# EAGLE schematic project (EAGLE 6.3)

## Sheet 1 of 6
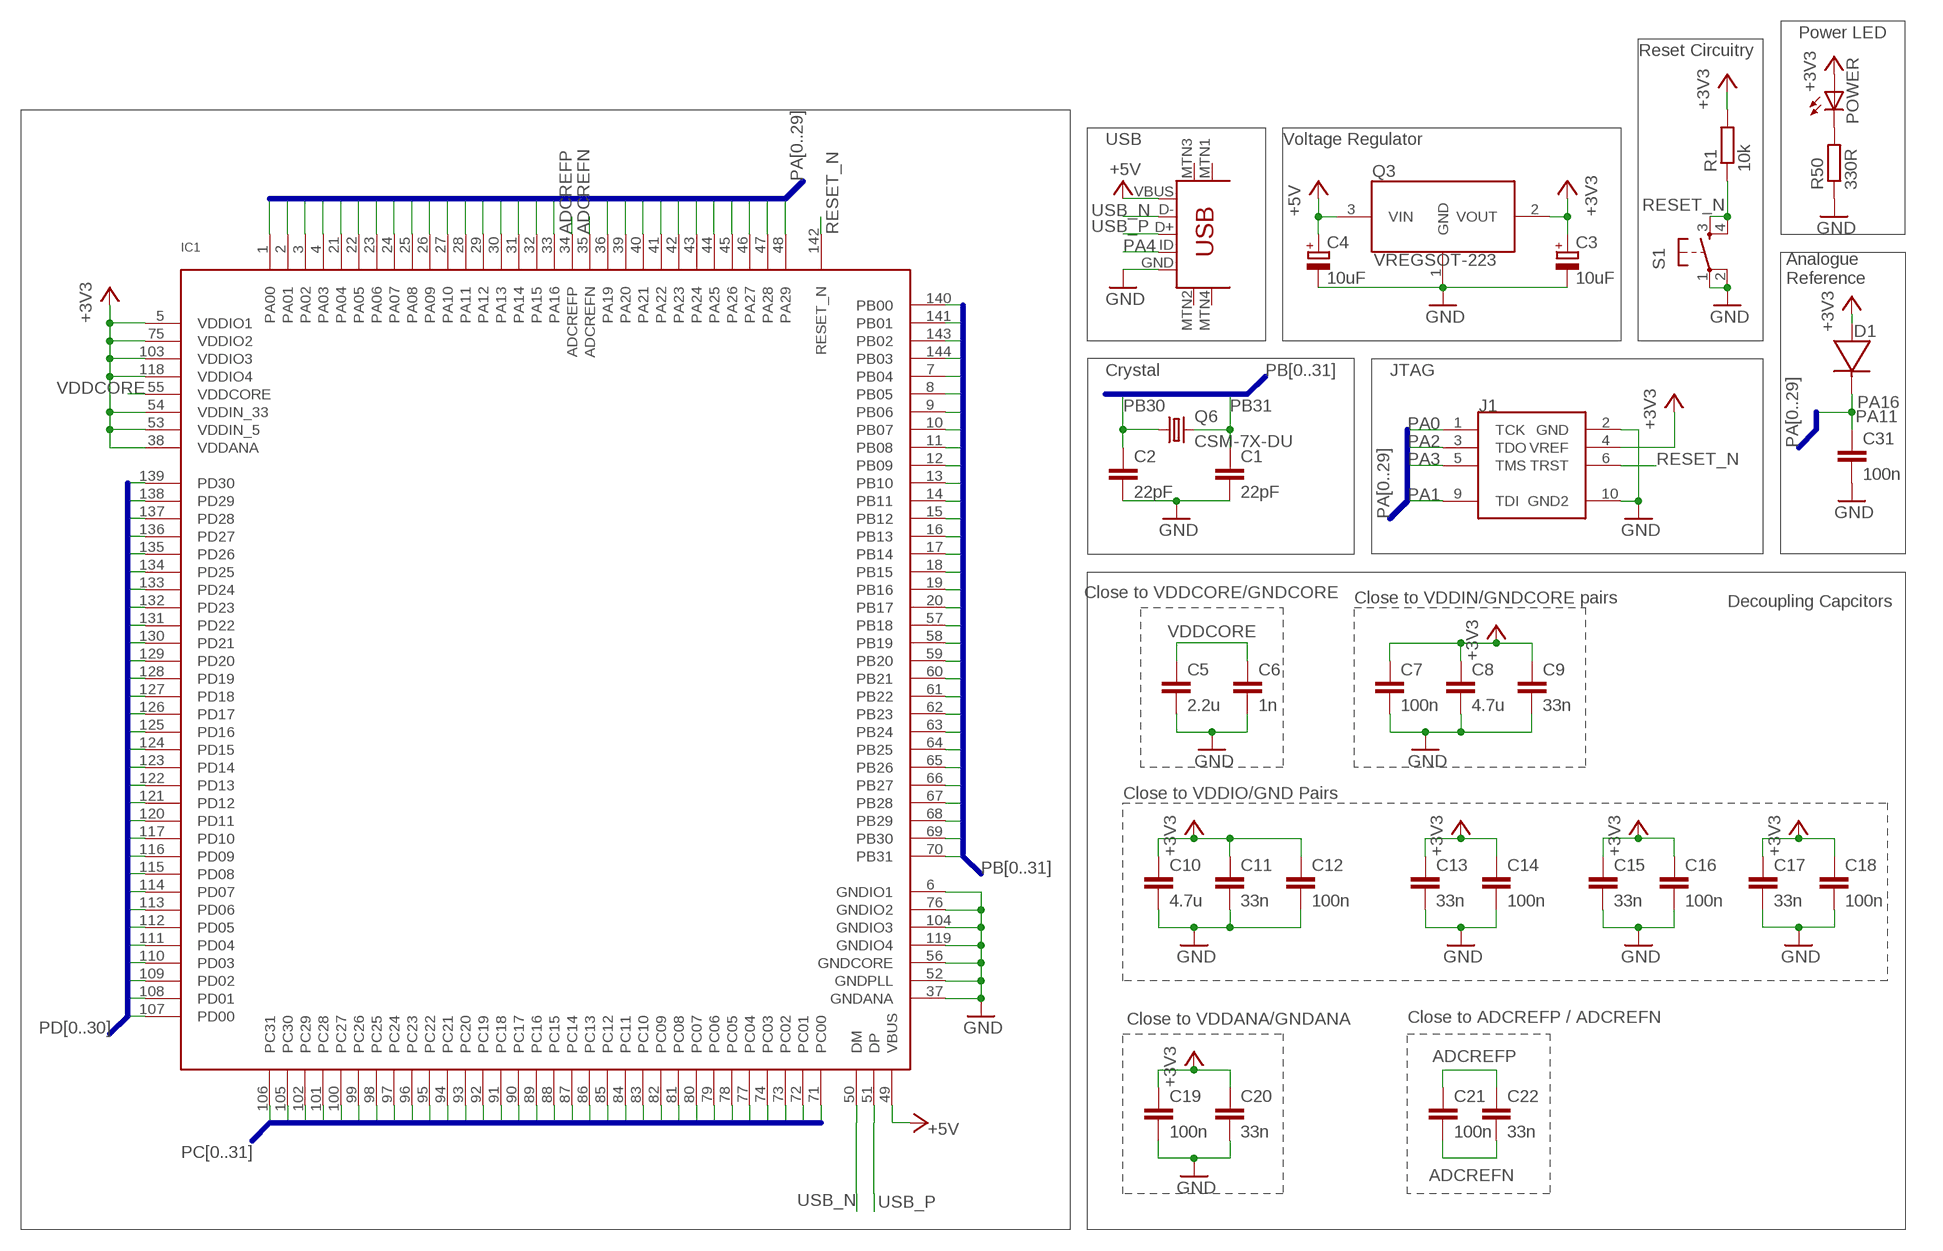
[diagram p0: schematic, sheet 1]

### Parts
C1  22pF  C-EUC0603  [C0603]
C2  22pF  C-EUC0603  [C0603]
C3  10uF  CPOL-EUSMCP  [SMC_P]
C4  10uF  CPOL-EUSMCP  [SMC_P]
C5  2.2u  C-EUC0603  [C0603]
C6  1n  C-EUC0603  [C0603]
C7  100n  C-EUC0603  [C0603]
C8  4.7u  C-EUC0603  [C0603]
C9  33n  C-EUC0603  [C0603]
C10  4.7u  C-EUC0603  [C0603]
C11  33n  C-EUC0603  [C0603]
C12  100n  C-EUC0603  [C0603]
C13  33n  C-EUC0603  [C0603]
C14  100n  C-EUC0603  [C0603]
C15  33n  C-EUC0603  [C0603]
C16  100n  C-EUC0603  [C0603]
C17  33n  C-EUC0603  [C0603]
C18  100n  C-EUC0603  [C0603]
C19  100n  C-EUC0603  [C0603]
C20  33n  C-EUC0603  [C0603]
C21  100n  C-EUC0603  [C0603]
C22  33n  C-EUC0603  [C0603]
C31  100n  C-EUC0603  [C0603]
D1  DIODESMD  [SMC_C]
IC1  UC3C  [TQFP144]
J1  JTAG2.54MM2X5TH  [2.54MM2X5TH]
POWER  LED1206  [LED-1206]
Q3  VREGSOT-223  [SOT-223]
Q6  CSM-7X-DU  [CSM-7X-DU]
R1  10k  R0603  [R0603]
R50  330R  R0603  [R0603]
S1  TAC_SWITCHSMD  [TACTILE_SWITCH_SMD]
U$1  USB-MINIB-5PIN  [USB-MINIB]

### Nets
+3V3: C3.+ C7.1 C8.1 C9.1 C10.1 C11.1 C12.1 C13.1 C14.1 C15.1 C16.1 C17.1 C18.1 C19.1 C20.1 D1.+(ANODE) IC1.5(VDDIO1) IC1.38(VDDANA) IC1.53(VDDIN_5) IC1.54(VDDIN_33) IC1.75(VDDIO2) IC1.103(VDDIO3) IC1.118(VDDIO4) J1.4(VREF) POWER.A Q3.2(VOUT) R1.2 ; also sheet 2,3,4,5,6
+5V: C4.+ IC1.49(VBUS) Q3.3(VIN) U$1.VBUS ; also sheet 6
ADCREFN: C21.2 C22.2 IC1.35(ADCREFN)
ADCREFP: C21.1 C22.1 IC1.34(ADCREFP)
GND: C1.2 C2.2 C3.- C4.- C5.2 C6.2 C7.2 C8.2 C9.2 C10.2 C11.2 C12.2 C13.2 C14.2 C15.2 C16.2 C17.2 C18.2 C19.2 C20.2 C31.2 IC1.6(GNDIO1) IC1.37(GNDANA) IC1.52(GNDPLL) IC1.56(GNDCORE) IC1.76(GNDIO2) IC1.104(GNDIO3) IC1.119(GNDIO4) J1.2(GND) J1.10(GND2) Q3.1(GND) R50.1 S1.1 S1.2 U$1.GND ; also sheet 2,3,4,5,6
N$36: POWER.C R50.2
PA0: IC1.1(PA00) J1.1(TCK)
PA1: IC1.2(PA01) J1.9(TDI)
PA2: IC1.3(PA02) J1.3(TDO)
PA3: IC1.4(PA03) J1.5(TMS)
PA4: IC1.21(PA04) U$1.ID
PA5: IC1.22(PA05) ; also sheet 6
PA6: IC1.23(PA06) ; also sheet 5
PA7: IC1.24(PA07) ; also sheet 5
PA8: IC1.25(PA08) ; also sheet 5
PA9: IC1.26(PA09) ; also sheet 5
PA10: IC1.27(PA10) ; also sheet 6
PA12: IC1.29(PA12) ; also sheet 6
PA13: IC1.30(PA13) ; also sheet 6
PA14: IC1.31(PA14) ; also sheet 6
PA15: IC1.32(PA15) ; also sheet 3
PA16: C31.1 D1.-(CATHODE) IC1.28(PA11) IC1.33(PA16)
PA19: IC1.36(PA19) ; also sheet 3
PA20: IC1.39(PA20) ; also sheet 3
PA21: IC1.40(PA21) ; also sheet 3
PA22: IC1.41(PA22) ; also sheet 3
PA23: IC1.42(PA23) ; also sheet 3
PA24: IC1.43(PA24) ; also sheet 3
PA25: IC1.44(PA25) ; also sheet 3
PA26: IC1.45(PA26) ; also sheet 3
PA27: IC1.46(PA27) ; also sheet 3
PA28: IC1.47(PA28) ; also sheet 3
PA29: IC1.48(PA29) ; also sheet 3
PB0: IC1.140(PB00) ; also sheet 3
PB1: IC1.141(PB01) ; also sheet 3
PB2: IC1.143(PB02) ; also sheet 3
PB3: IC1.144(PB03) ; also sheet 3
PB4: IC1.7(PB04) ; also sheet 3
PB5: IC1.8(PB05) ; also sheet 3
PB6: IC1.9(PB06) ; also sheet 3
PB7: IC1.10(PB07) ; also sheet 3
PB8: IC1.11(PB08) ; also sheet 5
PB9: IC1.12(PB09) ; also sheet 5
PB10: IC1.13(PB10) ; also sheet 5
PB11: IC1.14(PB11) ; also sheet 5
PB12: IC1.15(PB12) ; also sheet 5
PB13: IC1.16(PB13) ; also sheet 5
PB14: IC1.17(PB14) ; also sheet 5
PB15: IC1.18(PB15) ; also sheet 5
PB16: IC1.19(PB16) ; also sheet 5
PB17: IC1.20(PB17) ; also sheet 6
PB18: IC1.57(PB18) ; also sheet 6
PB19: IC1.58(PB19) ; also sheet 2,6
PB20: IC1.59(PB20) ; also sheet 2,6
PB21: IC1.60(PB21) ; also sheet 2,6
PB22: IC1.61(PB22) ; also sheet 6
PB23: IC1.62(PB23) ; also sheet 6
PB24: IC1.63(PB24) ; also sheet 6
PB25: IC1.64(PB25) ; also sheet 2,6
PB26: IC1.65(PB26) ; also sheet 2
PB27: IC1.66(PB27) ; also sheet 6
PB28: IC1.67(PB28) ; also sheet 6
PB29: IC1.68(PB29) ; also sheet 6
PB30: C2.1 IC1.69(PB30) Q6.1
PB31: C1.1 IC1.70(PB31) Q6.2
PC0: IC1.71(PC00) ; also sheet 6
PC1: IC1.72(PC01) ; also sheet 6
PC2: IC1.73(PC02) ; also sheet 2,6
PC3: IC1.74(PC03) ; also sheet 2,6
PC4: IC1.77(PC04) ; also sheet 6
PC5: IC1.78(PC05) ; also sheet 6
PC6: IC1.79(PC06) ; also sheet 6
PC7: IC1.80(PC07)
PC8: IC1.81(PC08) ; also sheet 4
PC9: IC1.82(PC09) ; also sheet 6
PC10: IC1.83(PC10) ; also sheet 6
PC11: IC1.84(PC11) ; also sheet 6
PC12: IC1.85(PC12) ; also sheet 6
PC13: IC1.86(PC13) ; also sheet 6
PC14: IC1.87(PC14) ; also sheet 4
PC15: IC1.88(PC15) ; also sheet 4
PC16: IC1.89(PC16) ; also sheet 4
PC17: IC1.90(PC17) ; also sheet 4
PC18: IC1.91(PC18) ; also sheet 4
PC19: IC1.92(PC19) ; also sheet 4
PC20: IC1.93(PC20) ; also sheet 4
PC21: IC1.94(PC21) ; also sheet 4
PC22: IC1.95(PC22) ; also sheet 4
PC23: IC1.96(PC23) ; also sheet 4
PC24: IC1.97(PC24) ; also sheet 4
PC25: IC1.98(PC25) ; also sheet 4
PC26: IC1.99(PC26) ; also sheet 4
PC27: IC1.100(PC27) ; also sheet 4
PC28: IC1.101(PC28) ; also sheet 4
PC29: IC1.102(PC29) ; also sheet 4
PC30: IC1.105(PC30) ; also sheet 4
PC31: IC1.106(PC31) ; also sheet 4
PD0: IC1.107(PD00) ; also sheet 4
PD1: IC1.108(PD01) ; also sheet 4
PD2: IC1.109(PD02) ; also sheet 4
PD3: IC1.110(PD03) ; also sheet 4
PD4: IC1.111(PD04) ; also sheet 6
PD5: IC1.112(PD05) ; also sheet 4
PD6: IC1.113(PD06) ; also sheet 4
PD7: IC1.114(PD07) ; also sheet 4
PD8: IC1.115(PD08) ; also sheet 4
PD9: IC1.116(PD09) ; also sheet 4
PD10: IC1.117(PD10) ; also sheet 4
PD11: IC1.120(PD11) ; also sheet 4
PD12: IC1.121(PD12) ; also sheet 4
PD13: IC1.122(PD13) ; also sheet 4
PD14: IC1.123(PD14) ; also sheet 4
PD15: IC1.124(PD15) ; also sheet 4
PD16: IC1.125(PD16)
PD17: IC1.126(PD17) ; also sheet 4
PD18: IC1.127(PD18)
PD19: IC1.128(PD19)
PD20: IC1.129(PD20) ; also sheet 4
PD21: IC1.130(PD21) ; also sheet 4
PD22: IC1.131(PD22)
PD23: IC1.132(PD23) ; also sheet 6
PD24: IC1.133(PD24) ; also sheet 4
PD25: IC1.134(PD25) ; also sheet 6
PD26: IC1.135(PD26) ; also sheet 6
PD27: IC1.136(PD27) ; also sheet 6
PD28: IC1.137(PD28) ; also sheet 6
PD29: IC1.138(PD29) ; also sheet 6
PD30: IC1.139(PD30) ; also sheet 6
RESET_N: IC1.142(RESET_N) J1.6(TRST) R1.1 S1.3 S1.4
USB_N: IC1.50(DM) U$1.D-
USB_P: IC1.51(DP) U$1.D+
VDDCORE: C5.1 C6.1 IC1.55(VDDCORE)
Unconnected: U$1.MTN1(MTN2) U$1.MTN2(MTN3) U$1.MTN3(MTN1) U$1.MTN4

### Buses
PA[0..29]
PB[0..31]
PD[0..30]
PC[0..31]

### Notes on the sheet
- Power LED
- Reset Circuitry
- USB | Voltage Regulator
- Analogue 
  Reference
- Crystal | JTAG
- PA11
- Close to VDDCORE/GNDCORE
- Close to VDDIN/GNDCORE pairs | Decoupling Capcitors
- Close to VDDIO/GND Pairs
- Close to VDDANA/GNDANA | Close to ADCREFP / ADCREFN

## Sheet 2 of 6
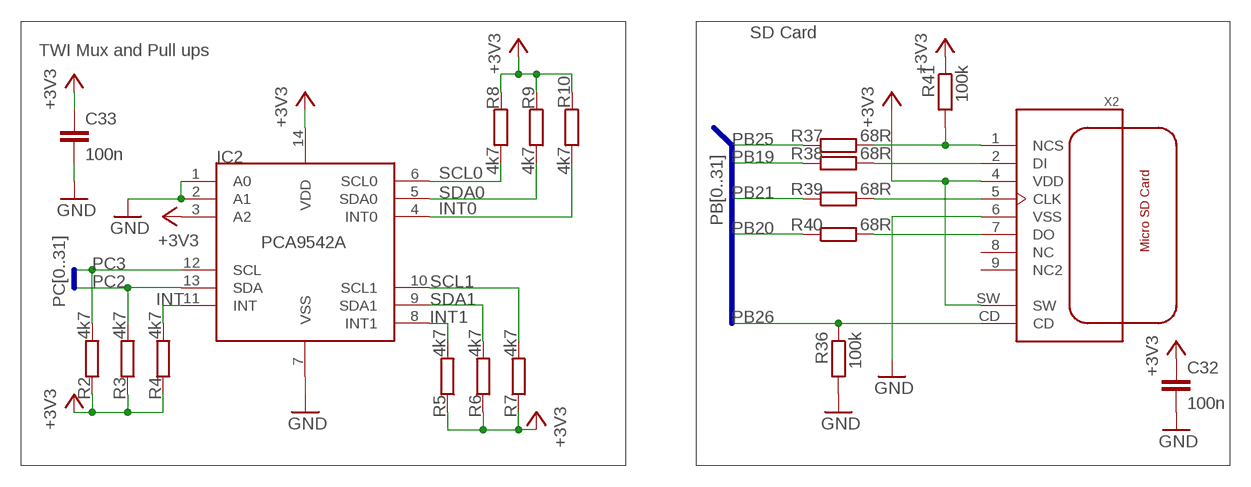
[diagram p1: schematic, sheet 2]

### Parts
C32  100n  C-EUC0603  [C0603]
C33  100n  C-EUC0603  [C0603]
IC2  PCA9542A  [TSSOP14]
R2  4k7  R0603  [R0603]
R3  4k7  R0603  [R0603]
R4  4k7  R0603  [R0603]
R5  4k7  R0603  [R0603]
R6  4k7  R0603  [R0603]
R7  4k7  R0603  [R0603]
R8  4k7  R0603  [R0603]
R9  4k7  R0603  [R0603]
R10  4k7  R0603  [R0603]
R36  100k  R0603  [R0603]
R37  68R  R0603  [R0603]
R38  68R  R0603  [R0603]
R39  68R  R0603  [R0603]
R40  68R  R0603  [R0603]
R41  100k  R0603  [R0603]
X2  MICROSDSMD  [MICROSD]

### Nets
+3V3: C32.1 C33.1 IC2.3(A2) IC2.14(VDD) R2.1 R3.1 R4.1 R5.1 R6.1 R7.1 R8.1 R9.1 R10.1 R41.1 X2.4(VDD) X2.SW ; also sheet 1,3,4,5,6
GND: C32.2 C33.2 IC2.1(A0) IC2.2(A1) IC2.7(VSS) R36.2 X2.6(VSS) ; also sheet 1,3,4,5,6
INT: IC2.11(INT) R4.2
INT0: IC2.4(INT0) R10.2
INT1: IC2.8(INT1) R5.2
N$23: R37.2 R41.2 X2.1(NCS)
N$25: R38.2 X2.2(DI)
N$26: R39.2 X2.5(CLK)
N$27: R40.2 X2.7(DO)
PB19: R38.1 ; also sheet 1,6
PB20: R40.1 ; also sheet 1,6
PB21: R39.1 ; also sheet 1,6
PB25: R37.1 ; also sheet 1,6
PB26: R36.1 X2.CD ; also sheet 1
PC2: IC2.13(SDA) R3.2 ; also sheet 1,6
PC3: IC2.12(SCL) R2.2 ; also sheet 1,6
SCL0: IC2.6(SCL0) R8.2 ; also sheet 3
SCL1: IC2.10(SCL1) R7.2 ; also sheet 3
SDA0: IC2.5(SDA0) R9.2 ; also sheet 3
SDA1: IC2.9(SDA1) R6.2 ; also sheet 3
Unconnected: X2.8(NC) X2.9(NC2)

### Buses
PC[0..31]
PB[0..31]

### Notes on the sheet
- SD Card
- TWI Mux and Pull ups

## Sheet 3 of 6
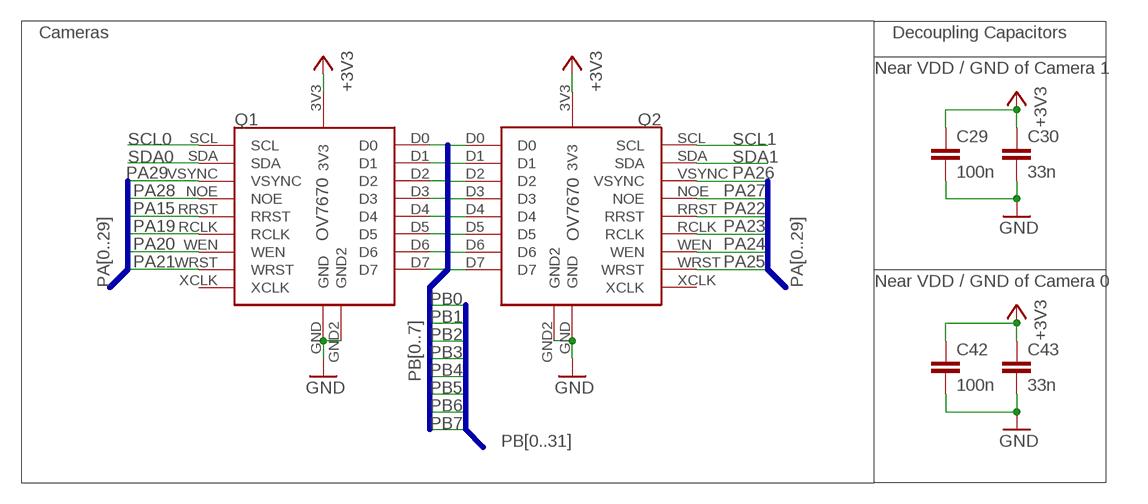
[diagram p2: schematic, sheet 3]

### Parts
C29  100n  C-EUC0603  [C0603]
C30  33n  C-EUC0603  [C0603]
C42  100n  C-EUC0603  [C0603]
C43  33n  C-EUC0603  [C0603]
Q1  OV7670  [OV7670]
Q2  OV7670  [OV7670]

### Nets
+3V3: C29.1 C30.1 C42.1 C43.1 Q1.3V3 Q2.3V3 ; also sheet 1,2,4,5,6
GND: C29.2 C30.2 C42.2 C43.2 Q1.GND Q1.GND2 Q2.GND Q2.GND2 ; also sheet 1,2,4,5,6
PA15: Q1.RRST ; also sheet 1
PA19: Q1.RCLK ; also sheet 1
PA20: Q1.WEN ; also sheet 1
PA21: Q1.WRST ; also sheet 1
PA22: Q2.RRST ; also sheet 1
PA23: Q2.RCLK ; also sheet 1
PA24: Q2.WEN ; also sheet 1
PA25: Q2.WRST ; also sheet 1
PA26: Q2.VSYNC ; also sheet 1
PA27: Q2.NOE ; also sheet 1
PA28: Q1.NOE ; also sheet 1
PA29: Q1.VSYNC ; also sheet 1
PB0: Q1.D0 Q2.D0 ; also sheet 1
PB1: Q1.D1 Q2.D1 ; also sheet 1
PB2: Q1.D2 Q2.D2 ; also sheet 1
PB3: Q1.D3 Q2.D3 ; also sheet 1
PB4: Q1.D4 Q2.D4 ; also sheet 1
PB5: Q1.D5 Q2.D5 ; also sheet 1
PB6: Q1.D6 Q2.D6 ; also sheet 1
PB7: Q1.D7 Q2.D7 ; also sheet 1
SCL0: Q1.SCL ; also sheet 2
SCL1: Q2.SCL ; also sheet 2
SDA0: Q1.SDA ; also sheet 2
SDA1: Q2.SDA ; also sheet 2
Unconnected: Q1.XCLK Q2.XCLK

### Buses
PB[0..7]
PB[0..31]
PA[0..29]

### Notes on the sheet
- Cameras | Decoupling Capacitors
- Near VDD / GND of Camera 1
- Near VDD / GND of Camera 0

## Sheet 4 of 6
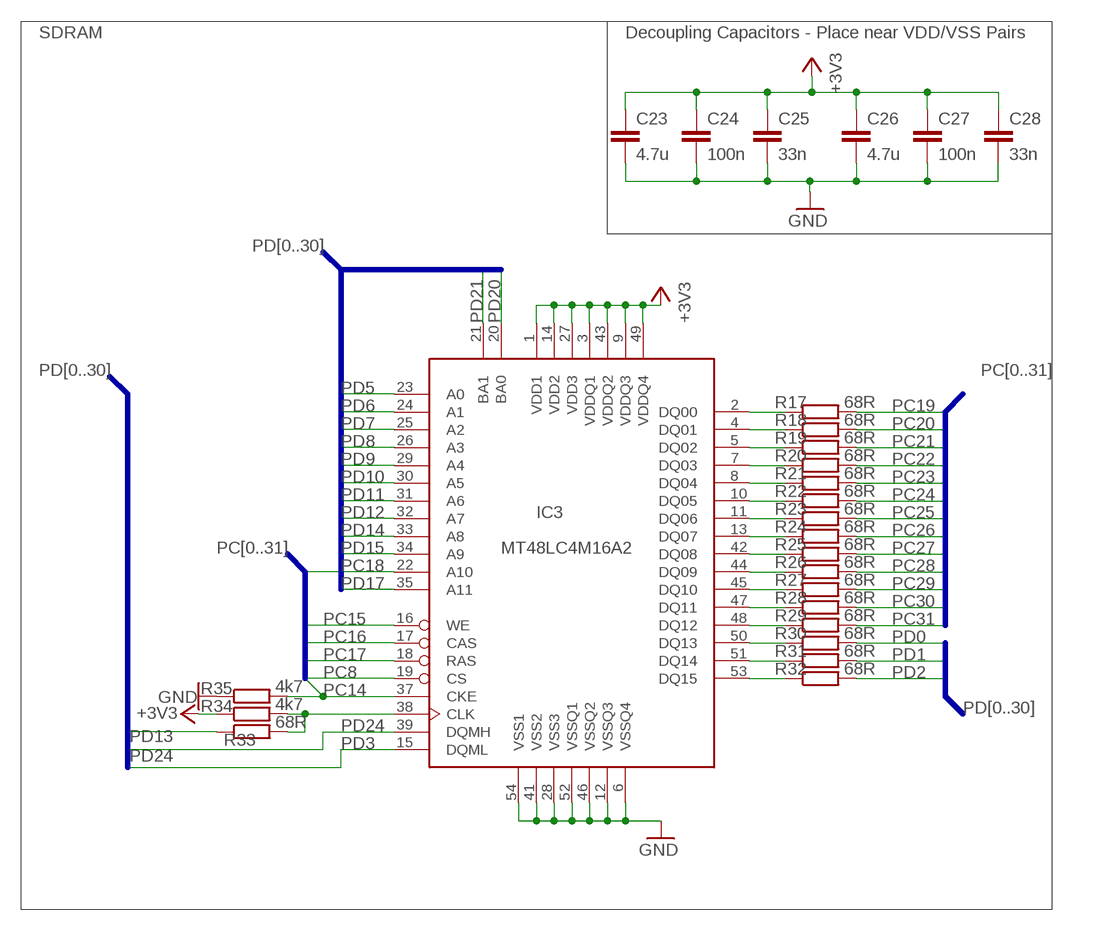
[diagram p3: schematic, sheet 4]

### Parts
C23  4.7u  C-EUC0603  [C0603]
C24  100n  C-EUC0603  [C0603]
C25  33n  C-EUC0603  [C0603]
C26  4.7u  C-EUC0603  [C0603]
C27  100n  C-EUC0603  [C0603]
C28  33n  C-EUC0603  [C0603]
IC3  MT48LC4M16A2TSOP54  [TSOP54]
R17  68R  R0603  [R0603]
R18  68R  R0603  [R0603]
R19  68R  R0603  [R0603]
R20  68R  R0603  [R0603]
R21  68R  R0603  [R0603]
R22  68R  R0603  [R0603]
R23  68R  R0603  [R0603]
R24  68R  R0603  [R0603]
R25  68R  R0603  [R0603]
R26  68R  R0603  [R0603]
R27  68R  R0603  [R0603]
R28  68R  R0603  [R0603]
R29  68R  R0603  [R0603]
R30  68R  R0603  [R0603]
R31  68R  R0603  [R0603]
R32  68R  R0603  [R0603]
R33  68R  R0603  [R0603]
R34  4k7  R0603  [R0603]
R35  4k7  R0603  [R0603]

### Nets
+3V3: C23.1 C24.1 C25.1 C26.1 C27.1 C28.1 IC3.1(VDD1) IC3.3(VDDQ1) IC3.9(VDDQ3) IC3.14(VDD2) IC3.27(VDD3) IC3.43(VDDQ2) IC3.49(VDDQ4) R34.1 ; also sheet 1,2,3,5,6
DQ00: IC3.2(DQ00) R17.1
DQ01: IC3.4(DQ01) R18.1
DQ02: IC3.5(DQ02) R19.1
DQ03: IC3.7(DQ03) R20.1
DQ04: IC3.8(DQ04) R21.1
DQ05: IC3.10(DQ05) R22.1
DQ06: IC3.11(DQ06) R23.1
DQ07: IC3.13(DQ07) R24.1
DQ08: IC3.42(DQ08) R25.1
DQ09: IC3.44(DQ09) R26.1
DQ10: IC3.45(DQ10) R27.1
DQ11: IC3.47(DQ11) R28.1
DQ12: IC3.48(DQ12) R29.1
DQ13: IC3.50(DQ13) R30.1
DQ14: IC3.51(DQ14) R31.1
DQ15: IC3.53(DQ15) R32.1
GND: C23.2 C24.2 C25.2 C26.2 C27.2 C28.2 IC3.6(VSSQ4) IC3.12(VSSQ3) IC3.28(VSS3) IC3.41(VSS2) IC3.46(VSSQ2) IC3.52(VSSQ1) IC3.54(VSS1) R35.1 ; also sheet 1,2,3,5,6
PC8: IC3.19(CS) ; also sheet 1
PC14: IC3.37(CKE) R35.2 ; also sheet 1
PC15: IC3.16(WE) ; also sheet 1
PC16: IC3.17(CAS) ; also sheet 1
PC17: IC3.18(RAS) ; also sheet 1
PC18: IC3.22(A10) ; also sheet 1
PC19: R17.2 ; also sheet 1
PC20: R18.2 ; also sheet 1
PC21: R19.2 ; also sheet 1
PC22: R20.2 ; also sheet 1
PC23: R21.2 ; also sheet 1
PC24: R22.2 ; also sheet 1
PC25: R23.2 ; also sheet 1
PC26: R24.2 ; also sheet 1
PC27: R25.2 ; also sheet 1
PC28: R26.2 ; also sheet 1
PC29: R27.2 ; also sheet 1
PC30: R28.2 ; also sheet 1
PC31: R29.2 ; also sheet 1
PD0: R30.2 ; also sheet 1
PD1: R31.2 ; also sheet 1
PD2: R32.2 ; also sheet 1
PD3: IC3.15(DQML) ; also sheet 1
PD5: IC3.23(A0) ; also sheet 1
PD6: IC3.24(A1) ; also sheet 1
PD7: IC3.25(A2) ; also sheet 1
PD8: IC3.26(A3) ; also sheet 1
PD9: IC3.29(A4) ; also sheet 1
PD10: IC3.30(A5) ; also sheet 1
PD11: IC3.31(A6) ; also sheet 1
PD12: IC3.32(A7) ; also sheet 1
PD13: R33.1 ; also sheet 1
PD14: IC3.33(A8) ; also sheet 1
PD15: IC3.34(A9) ; also sheet 1
PD17: IC3.35(A11) ; also sheet 1
PD20: IC3.20(BA0) ; also sheet 1
PD21: IC3.21(BA1) ; also sheet 1
PD24: IC3.39(DQMH) ; also sheet 1
SDRAMCLK: IC3.38(CLK) R33.2 R34.2

### Buses
PC[0..31]
PD[0..30]

### Notes on the sheet
- SDRAM | Decoupling Capacitors - Place near VDD/VSS Pairs

## Sheet 5 of 6
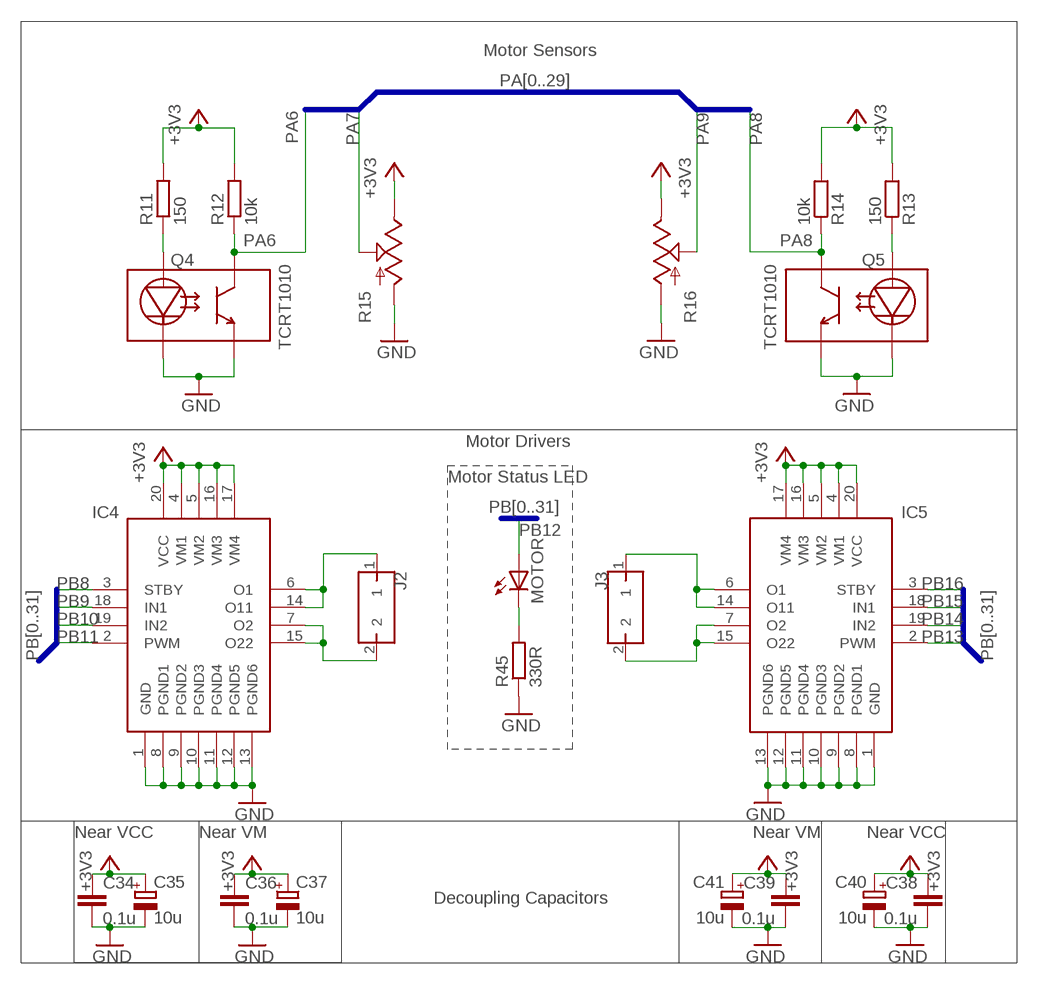
[diagram p4: schematic, sheet 5]

### Parts
C34  0.1u  C-EUC0603  [C0603]
C35  10u  CPOL-EUSMCZ  [SMC_Z]
C36  0.1u  C-EUC0603  [C0603]
C37  10u  CPOL-EUSMCZ  [SMC_Z]
C38  0.1u  C-EUC0603  [C0603]
C39  0.1u  C-EUC0603  [C0603]
C40  10u  CPOL-EUSMCZ  [SMC_Z]
C41  10u  CPOL-EUSMCZ  [SMC_Z]
IC4  TB6593FNGSSOP20  [SSOP20]
IC5  TB6593FNGSSOP20  [SSOP20]
J2  1BY2THROUGHHOLE  [1BY2]
J3  1BY2THROUGHHOLE  [1BY2]
MOTOR  LED1206  [LED-1206]
Q4  TCRT1010TH  [TCRT1010]
Q5  TCRT1010TH  [TCRT1010]
R11  150  R0603  [R0603]
R12  10k  R0603  [R0603]
R13  150  R0603  [R0603]
R14  10k  R0603  [R0603]
R15  POTTRIM  [TRIM_POT]
R16  POTTRIM  [TRIM_POT]
R45  330R  R0603  [R0603]

### Nets
+3V3: C34.1 C35.+ C36.1 C37.+ C38.1 C39.1 C40.+ C41.+ IC4.4(VM1) IC4.5(VM2) IC4.16(VM3) IC4.17(VM4) IC4.20(VCC) IC5.4(VM1) IC5.5(VM2) IC5.16(VM3) IC5.17(VM4) IC5.20(VCC) R11.2 R12.2 R13.2 R14.2 R15.2(E) R16.2(E) ; also sheet 1,2,3,4,6
GND: C34.2 C35.- C36.2 C37.- C38.2 C39.2 C40.- C41.- IC4.1(GND) IC4.8(PGND1) IC4.9(PGND2) IC4.10(PGND3) IC4.11(PGND4) IC4.12(PGND5) IC4.13(PGND6) IC5.1(GND) IC5.8(PGND1) IC5.9(PGND2) IC5.10(PGND3) IC5.11(PGND4) IC5.12(PGND5) IC5.13(PGND6) Q4.CATHODE Q4.EMMITTER Q5.CATHODE Q5.EMMITTER R15.3(A) R16.3(A) R45.1 ; also sheet 1,2,3,4,6
M11: IC4.6(O1) IC4.14(O11) J2.1
M12: IC4.7(O2) IC4.15(O22) J2.2
M21: IC5.6(O1) IC5.14(O11) J3.1
M22: IC5.7(O2) IC5.15(O22) J3.2
N$5: Q4.ANODE R11.1
N$6: Q5.ANODE R13.1
N$31: MOTOR.C R45.2
PA6: Q4.COLLECTOR R12.1 ; also sheet 1
PA7: R15.1(S) ; also sheet 1
PA8: Q5.COLLECTOR R14.1 ; also sheet 1
PA9: R16.1(S) ; also sheet 1
PB8: IC4.3(STBY) ; also sheet 1
PB9: IC4.18(IN1) ; also sheet 1
PB10: IC4.19(IN2) ; also sheet 1
PB11: IC4.2(PWM) ; also sheet 1
PB12: MOTOR.A ; also sheet 1
PB13: IC5.2(PWM) ; also sheet 1
PB14: IC5.19(IN2) ; also sheet 1
PB15: IC5.18(IN1) ; also sheet 1
PB16: IC5.3(STBY) ; also sheet 1

### Buses
PA[0..29]
PB[0..31]

### Notes on the sheet
- Motor Sensors
- Motor Drivers
- Motor Status LED
- Near VCC | Near VM | Near VM | Near VCC
- Decoupling Capacitors

## Sheet 6 of 6
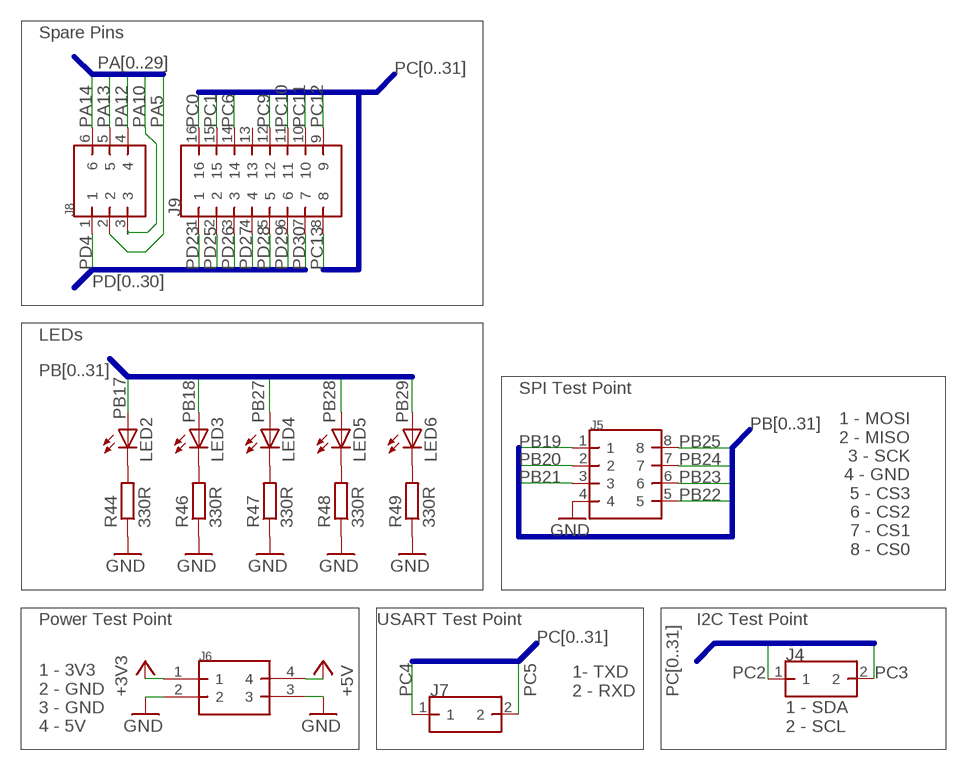
[diagram p5: schematic, sheet 6]

### Parts
J4  1BY2THROUGHHOLE  [1BY2]
J5  8PIN2.54MM2X4TH  [2.54MM2X4TH]
J6  4PIN2.54MM2X2TH  [2.54MM2X2TH]
J7  1BY2THROUGHHOLE  [1BY2]
J8  6PIN2.54MM2X3TH  [2.54MM2X3TH]
J9  16PIN2.54MM2X8TH  [2.54MM2X8TH]
LED2  LED1206  [LED-1206]
LED3  LED1206  [LED-1206]
LED4  LED1206  [LED-1206]
LED5  LED1206  [LED-1206]
LED6  LED1206  [LED-1206]
R44  330R  R0603  [R0603]
R46  330R  R0603  [R0603]
R47  330R  R0603  [R0603]
R48  330R  R0603  [R0603]
R49  330R  R0603  [R0603]

### Nets
+3V3: J6.1 ; also sheet 1,2,3,4,5
+5V: J6.4 ; also sheet 1
GND: J5.4 J6.2 J6.3 R44.1 R46.1 R47.1 R48.1 R49.1 ; also sheet 1,2,3,4,5
N$30: LED2.C R44.2
N$32: LED3.C R46.2
N$33: LED4.C R47.2
N$34: LED5.C R48.2
N$35: LED6.C R49.2
PA5: J8.2 ; also sheet 1
PA10: J8.3 ; also sheet 1
PA12: J8.4 ; also sheet 1
PA13: J8.5 ; also sheet 1
PA14: J8.6 ; also sheet 1
PB17: LED2.A ; also sheet 1
PB18: LED3.A ; also sheet 1
PB19: J5.1 ; also sheet 1,2
PB20: J5.2 ; also sheet 1,2
PB21: J5.3 ; also sheet 1,2
PB22: J5.5 ; also sheet 1
PB23: J5.6 ; also sheet 1
PB24: J5.7 ; also sheet 1
PB25: J5.8 ; also sheet 1,2
PB27: LED4.A ; also sheet 1
PB28: LED5.A ; also sheet 1
PB29: LED6.A ; also sheet 1
PC0: J9.16 ; also sheet 1
PC1: J9.15 ; also sheet 1
PC2: J4.1 ; also sheet 1,2
PC3: J4.2 ; also sheet 1,2
PC4: J7.1 ; also sheet 1
PC5: J7.2 ; also sheet 1
PC6: J9.14 ; also sheet 1
PC9: J9.12 ; also sheet 1
PC10: J9.11 ; also sheet 1
PC11: J9.10 ; also sheet 1
PC12: J9.9 ; also sheet 1
PC13: J9.8 ; also sheet 1
PD4: J8.1 ; also sheet 1
PD23: J9.1 ; also sheet 1
PD25: J9.2 ; also sheet 1
PD26: J9.3 ; also sheet 1
PD27: J9.4 ; also sheet 1
PD28: J9.5 ; also sheet 1
PD29: J9.6 ; also sheet 1
PD30: J9.7 ; also sheet 1
Unconnected: J9.13

### Buses
PC[0..31]
PB[0..31]
PA[0..29]
PD[0..30]

### Notes on the sheet
- Spare Pins
- LEDs
- SPI Test Point
- 1 - MOSI
  2 - MISO
  3 - SCK
  4 - GND
  5 - CS3
  6 - CS2
  7 - CS1
  8 - CS0
- Power Test Point | USART Test Point | I2C Test Point
- 1- TXD
  2 - RXD
- 1 - 3V3
  2 - GND
  3 - GND
  4 - 5V
- 1 - SDA
  2 - SCL

## Library data of the parts
C1 C2 C5-C34 C36 C38 C39 C42 C43 = passives:C-EU: CAPACITOR, European symbol
C3 C4 C35 C37 C40 C41 = passives:CPOL-EU: POLARIZED CAPACITOR, European symbol
D1 = Semiconductors:DIODE
IC1 = Atmel_MCUs:UC3C: AT32UC3C0512C Schematic and Footprint
IC2 = ICs:PCA9542A
IC3 = ICs:MT48LC4M16A2
IC4 IC5 = ICs:TB6593FNG
J1 = Headers:JTAG: JTAG Header
J2-J4 J7 = Headers:1BY2: 2 pads seperated by 0.1" for small connector block
J5 = Headers:8PIN
J6 = Headers:4PIN
J8 = Headers:6PIN
J9 = Headers:16PIN
LED2-LED6 MOTOR POWER = Semiconductors:LED: LEDs Standard schematic elements and footprints for 5mm, 3mm, 1206, and 0603 sized LEDs. 5mm - Spark Fun Electronics SKU : COM-00529 (and others)
Q1 Q2 = Misc:OV7670
Q3 = Semiconductors:VREG
Q4 Q5 = Sensors:TCRT1010: TCRT1010 Infrared optical emmitter and sensor.
Q6 = crystal:CSM-7X-DU: SMD CRYSTAL Source: www.ecsxtal.com .. Crystal 3.6864MHz CSM_7X_DU.PDF; OC_FARNELL: unknown; OC_NEWARK: unknown
R1-R14 R17-R41 R44-R50 = passives:R
R15 R16 = SparkFun:POT
S1 = SparkFun:TAC_SWITCH: Momentary Switch Button commonly used for reset or general input. Spark Fun Electronics SKU : COM-00097
U$1 = SparkFun:USB-MINIB: Mini-USB "B" connector with 5th pin broken out. Created new symbol breaking out 5th "ID" pin in mini/micro USB connector spec. See: http://en.wikipedia.org/wiki/Mini_usb#Cables. Uses same footprint as 4-pin symbol. Also added pins to connect to mounting / shield pads if required (probably not generally needed as signals aren't shielded once they leave the connector).
X2 = Misc:MICROSD